# EAGLE design snarfbasebasics232-v03i (EAGLE 5.11)
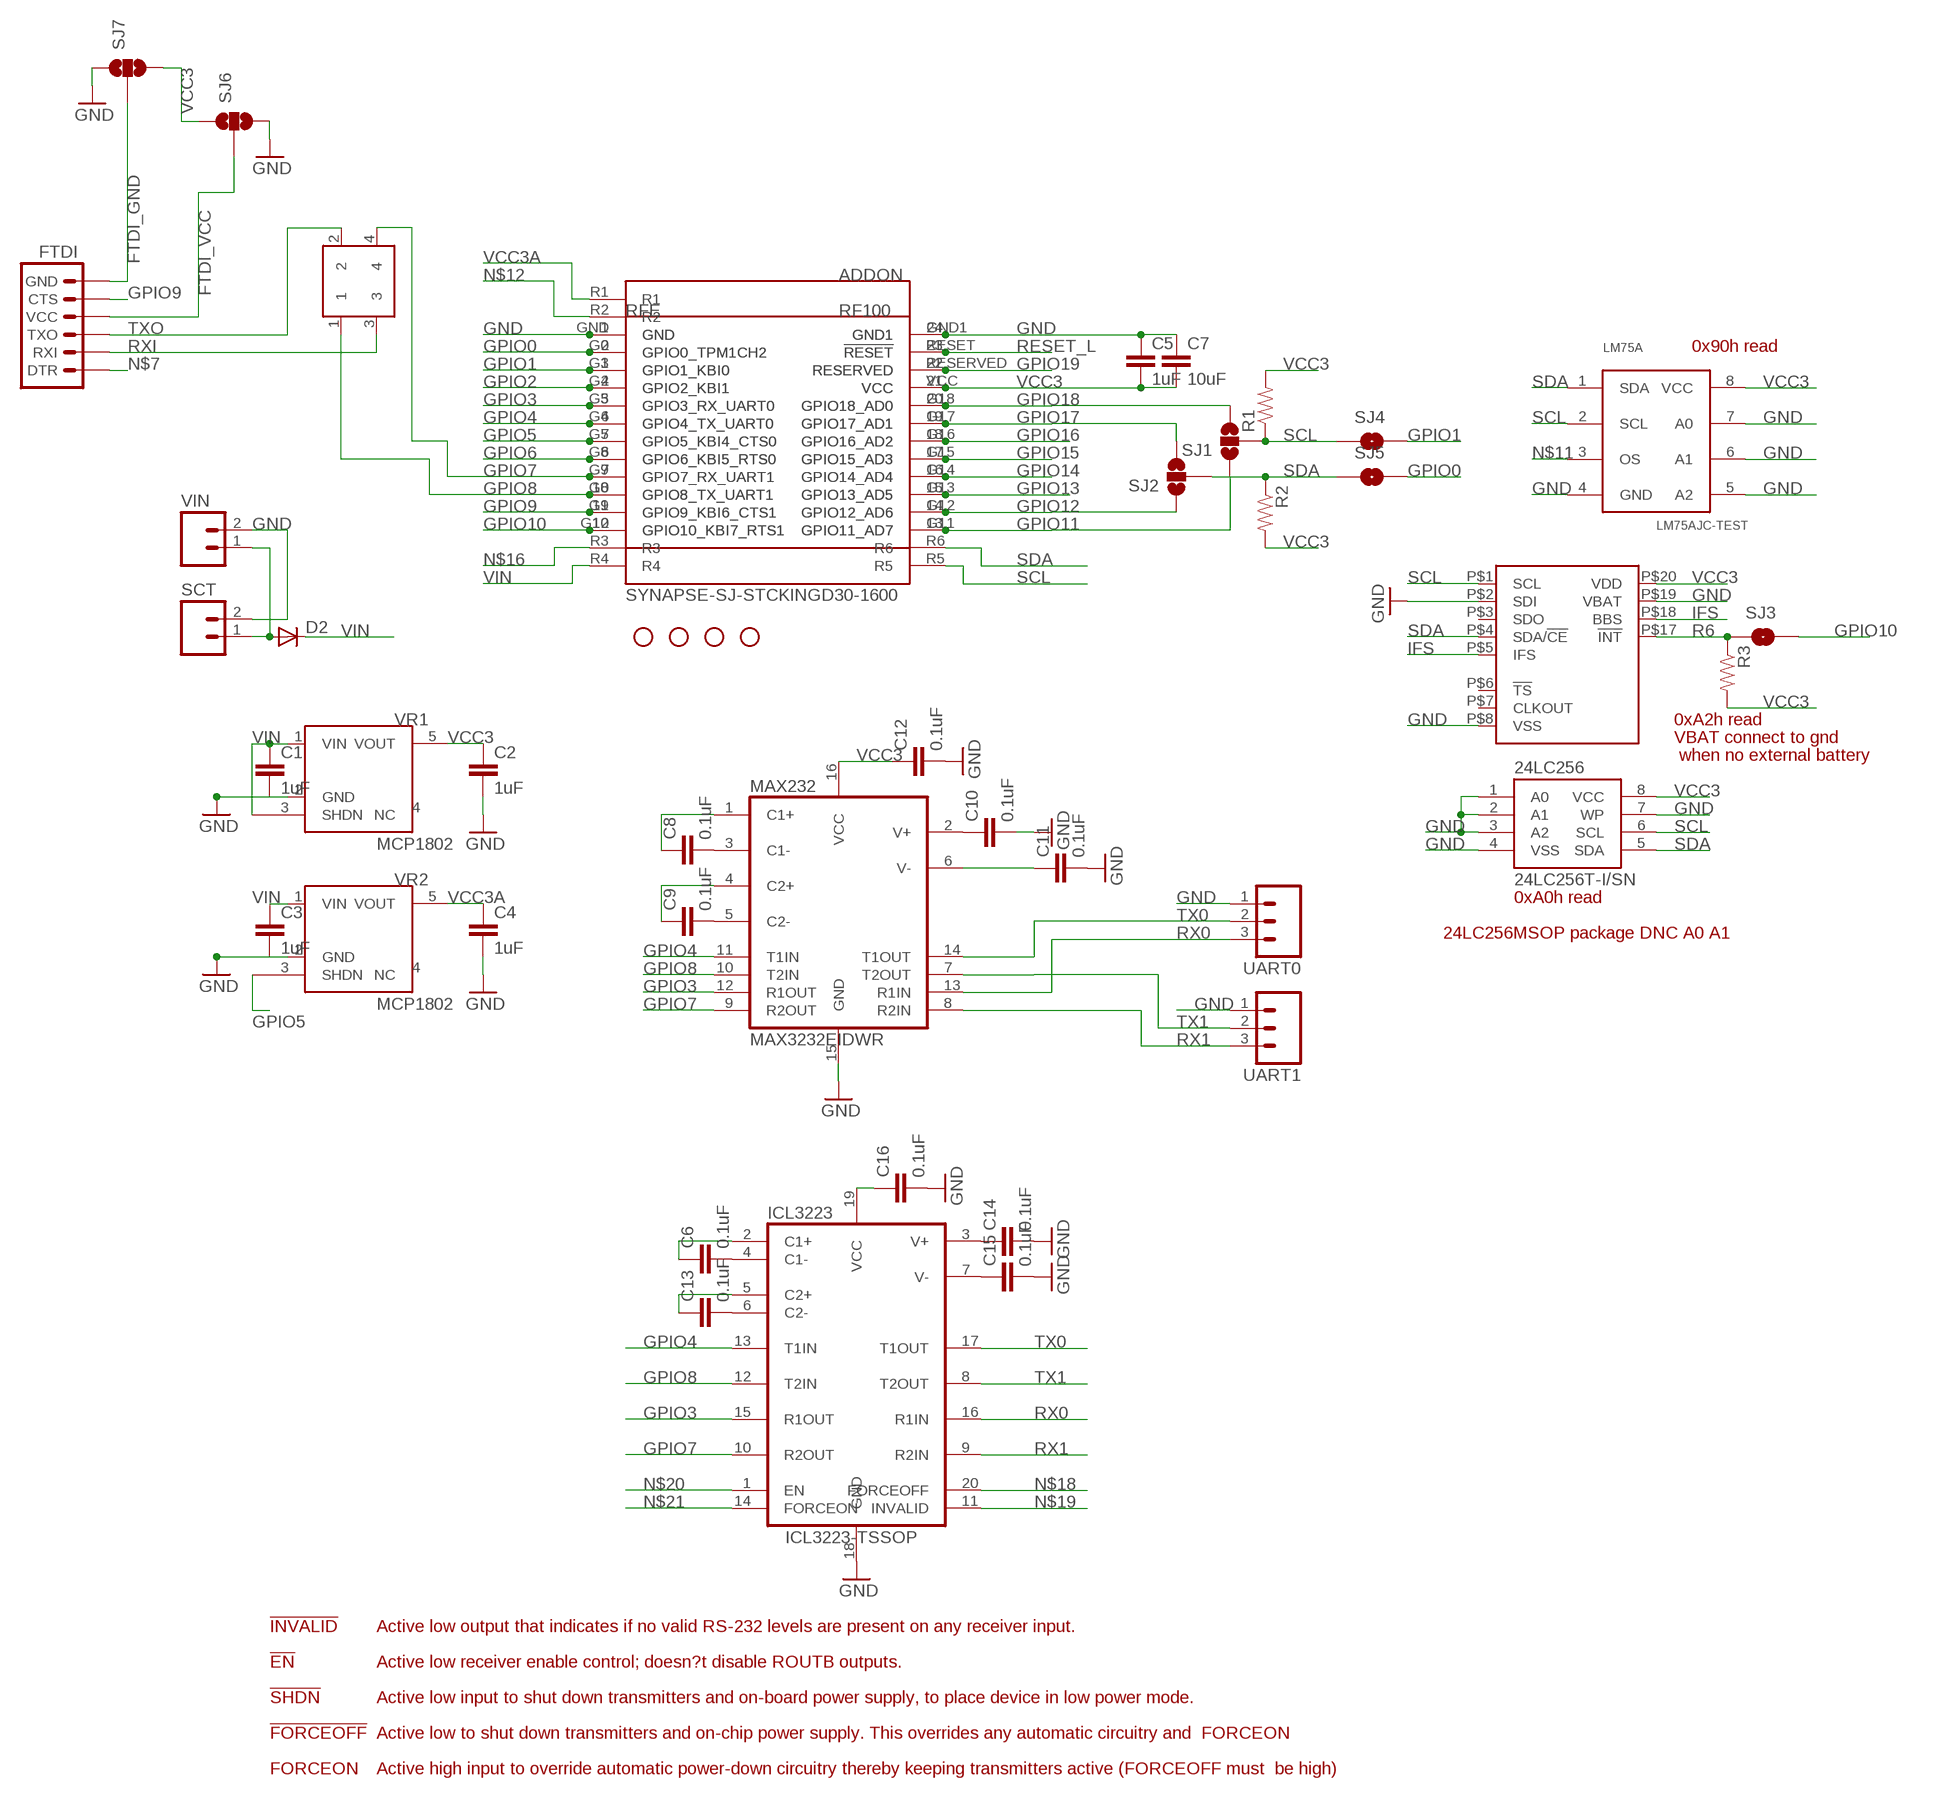
[diagram p0: schematic, sheet 1]

## Parts
24LC256  24LC256T-I/SN  EEPROM-I2CSMD  [SO08]
ADDON  SYNAPSE-SJ-STCKINGD30-1600  [SYNSJ-STACK]
C1  1uF  CAP0805  [0805]
C2  1uF  CAP0805  [0805]
C3  1uF  CAP0805  [0805]
C4  1uF  CAP0805  [0805]
C5  1uF  CAP0805  [0805]
C6  0.1uF  CAP0805  [0805]
C7  10uF  CAP0805  [0805]
C8  0.1uF  CAP0805  [0805]
C9  0.1uF  CAP0805  [0805]
C10  0.1uF  CAP0805  [0805]
C11  0.1uF  CAP0805  [0805]
C12  0.1uF  CAP0805  [0805]
C13  0.1uF  CAP0805  [0805]
C14  0.1uF  CAP0805  [0805]
C15  0.1uF  CAP0805  [0805]
C16  0.1uF  CAP0805  [0805]
D2  DIODESMA  [SMA-DIODE]
FTDI  ARDUINO_SERIAL_PROGRAMPTH  [1X06]
JP6  STAND-OFF  [STAND-OFF]
JP9  STAND-OFF  [STAND-OFF]
JP10  STAND-OFF  [STAND-OFF]
JP11  STAND-OFF  [STAND-OFF]
LM75A  LM75AJC-TEST  [TSSOP8-3MM]
MAX232  MAX3232EIDWR  MAX232SOIC16  [SO016]
PCF2129A  PCF2129ASO20  [SO20W]
R1  RESISTOR  [0805]
R2  RESISTOR  [0805]
R3  RESISTOR  [0805]
RFE  RFE  RF100-JACKJACK2  [SYNAPSERFENGINE-THM-SMT-JACK2]
RXTX  SERIAL_CROSSOVER  [2X02_PTH]
SCT  M023.5MM  [SCREWTERMINAL-3.5MM-2]
SJ1  SOLDERJUMPER_2WAYS  [SJ_3]
SJ2  SOLDERJUMPER_2WAYS  [SJ_3]
SJ3  SOLDERJUMPERNC2  [SJ_2S-NOTRACE]
SJ4  SOLDERJUMPERNO  [SJ_2S-NO]
SJ5  SOLDERJUMPERNO  [SJ_2S-NO]
SJ6  SOLDERJUMPER_2WAYPASTE1&2  [SJ_3_PASTE1&2]
SJ7  SOLDERJUMPER_2WAYPASTE1&2  [SJ_3_PASTE1&2]
U$1  ICL3223-TSSOP  [TSSOP20]
UART0  M03PTH  [1X03]
UART1  M03PTH  [1X03]
VIN  M02PTH  [1X02]
VR1  MCP1802  [SOT23-5]
VR2  MCP1802  [SOT23-5]

## Nets
FTDI_GND: FTDI.6(GND) SJ7.2
FTDI_VCC: FTDI.4(VCC) SJ6.2
GND: 24LC256.1(A0) 24LC256.2(A1) 24LC256.3(A2) 24LC256.4(VSS) 24LC256.7(WP) ADDON.GND ADDON.GND1 C1.2 C2.2 C3.2 C4.2 C5.1 C7.1 C10.2 C11.2 C12.2 C14.2 C15.2 C16.2 LM75A.4(GND) LM75A.5(A2) LM75A.6(A1) LM75A.7(A0) MAX232.15(GND) PCF2129A.P$2(SDI) PCF2129A.P$8(VSS) PCF2129A.P$19(VBAT) RFE.1(GND) RFE.24(GND1) RFE.P1 RFE.P24 RFE.P201 RFE.P224 SCT.2 SJ6.3 SJ7.1 U$1.18(GND) UART0.1 UART1.1 VIN.2 VR1.2(GND) VR2.2(GND)
GPIO0: ADDON.G0(GPIO0_TPM1CH2) RFE.2(GPIO0_TPM1CH2) RFE.P2 RFE.P202 SJ5.2
GPIO1: ADDON.G1(GPIO1_KBI0) RFE.3(GPIO1_KBI0) RFE.P3 RFE.P203 SJ4.2
GPIO2: ADDON.G2(GPIO2_KBI1) RFE.4(GPIO2_KBI1) RFE.P4 RFE.P204
GPIO3: ADDON.G3(GPIO3_RX_UART0) MAX232.12(R1OUT) RFE.5(GPIO3_RX_UART0) RFE.P5 RFE.P205 U$1.15(R1OUT)
GPIO4: ADDON.G4(GPIO4_TX_UART0) MAX232.11(T1IN) RFE.6(GPIO4_TX_UART0) RFE.P6 RFE.P206 U$1.13(T1IN)
GPIO5: ADDON.G5(GPIO5_KBI4_CTS0) RFE.7(GPIO5_KBI4_CTS0) RFE.P7 RFE.P207 VR2.3(SHDN)
GPIO6: ADDON.G6(GPIO6_KBI5_RTS0) RFE.8(GPIO6_KBI5_RTS0) RFE.P8 RFE.P208
GPIO7: ADDON.G7(GPIO7_RX_UART1) MAX232.9(R2OUT) RFE.9(GPIO7_RX_UART1) RFE.P9 RFE.P209 RXTX.4 U$1.10(R2OUT)
GPIO8: ADDON.G8(GPIO8_TX_UART1) MAX232.10(T2IN) RFE.10(GPIO8_TX_UART1) RFE.P10 RFE.P210 RXTX.1 U$1.12(T2IN)
GPIO9: ADDON.G9(GPIO9_KBI6_CTS1) FTDI.5(CTS) RFE.11(GPIO9_KBI6_CTS1) RFE.P11 RFE.P211
GPIO10: ADDON.G10(GPIO10_KBI7_RTS1) RFE.12(GPIO10_KBI7_RTS1) RFE.P12 RFE.P212 SJ3.2
GPIO11: ADDON.G11(GPIO11_AD7) RFE.13(GPIO11_AD7) RFE.P13 RFE.P213 SJ1.1
GPIO12: ADDON.G12(GPIO12_AD6) RFE.14(GPIO12_AD6) RFE.P14 RFE.P214 SJ2.1
GPIO13: ADDON.G13(GPIO13_AD5) RFE.15(GPIO13_AD5) RFE.P15 RFE.P215
GPIO14: ADDON.G14(GPIO14_AD4) RFE.16(GPIO14_AD4) RFE.P16 RFE.P216
GPIO15: ADDON.G15(GPIO15_AD3) RFE.17(GPIO15_AD3) RFE.P17 RFE.P217
GPIO16: ADDON.G16(GPIO16_AD2) RFE.18(GPIO16_AD2) RFE.P18 RFE.P218
GPIO17: ADDON.G17(GPIO17_AD1) RFE.19(GPIO17_AD1) RFE.P19 RFE.P219 SJ2.3
GPIO18: ADDON.G18(GPIO18_AD0) RFE.20(GPIO18_AD0) RFE.P20 RFE.P220 SJ1.3
GPIO19: ADDON.RESERVED RFE.22(RESERVED) RFE.P22 RFE.P222
IFS: PCF2129A.P$5(IFS) PCF2129A.P$18(BBS)
N$1: C8.2 MAX232.3(C1-)
N$2: D2.A SCT.1 VIN.1
N$3: C6.2 U$1.4(C1-)
N$4: C9.2 MAX232.5(C2-)
N$5: C10.1 MAX232.2(V+)
N$6: C11.1 MAX232.6(V-)
N$7: FTDI.1(DTR)
N$8: C8.1 MAX232.1(C1+)
N$9: C13.2 U$1.6(C2-)
N$10: C9.1 MAX232.4(C2+)
N$11: LM75A.3(OS)
N$12: ADDON.R2
N$13: C14.1 U$1.3(V+)
N$14: C15.1 U$1.7(V-)
N$15: C13.1 U$1.5(C2+)
N$16: ADDON.R3
N$17: C6.1 U$1.2(C1+)
N$18: U$1.20(FORCEOFF)
N$19: U$1.11(INVALID)
N$20: U$1.1(EN)
N$21: U$1.14(FORCEON)
R6: PCF2129A.P$17(!INT) R3.1 SJ3.1
RESET_L: ADDON.RESET(!RESET) RFE.23(!RESET) RFE.P23 RFE.P223
RX0: MAX232.13(R1IN) U$1.16(R1IN) UART0.3
RX1: MAX232.8(R2IN) U$1.9(R2IN) UART1.3
RXI: FTDI.2(RXI) RXTX.3
SCL: 24LC256.6(SCL) ADDON.R5 LM75A.2(SCL) PCF2129A.P$1(SCL) R1.1 SJ1.2 SJ4.1
SDA: 24LC256.5(SDA) ADDON.R6 LM75A.1(SDA) PCF2129A.P$4(SDA/!CE) R2.1 SJ2.2 SJ5.1
TX0: MAX232.14(T1OUT) U$1.17(T1OUT) UART0.2
TX1: MAX232.7(T2OUT) U$1.8(T2OUT) UART1.2
TXO: FTDI.3(TXO) RXTX.2
VCC3: 24LC256.8(VCC) ADDON.VCC C2.1 C5.2 C7.2 C12.1 C16.1 LM75A.8(VCC) MAX232.16(VCC) PCF2129A.P$20(VDD) R1.2 R2.2 R3.2 RFE.21(VCC) RFE.P21 RFE.P221 SJ6.1 SJ7.3 U$1.19(VCC) VR1.5(VOUT)
VCC3A: ADDON.R1 C4.1 VR2.5(VOUT)
VIN: ADDON.R4 C1.1 C3.1 D2.C VR1.1(VIN) VR1.3(SHDN) VR2.1(VIN)
Unconnected: PCF2129A.P$3(SDO) PCF2129A.P$6(!TS) PCF2129A.P$7(CLKOUT) VR1.4(NC) VR2.4(NC)

## Notes on the sheet
- 0x90h read
- 0xA2h read
- VBAT connect to gnd
- when no external battery
- 0xA0h read
- 24LC256MSOP package DNC A0 A1
- !INVALID | Active low output that indicates if no valid RS-232 levels are present on any receiver input.
- !EN | Active low receiver enable control; doesn?t disable ROUTB outputs.
- !SHDN | Active low input to shut down transmitters and on-board power supply, to place device in low power mode.
- !FORCEOFF | Active low to shut down transmitters and on-chip power supply. This overrides any automatic circuitry and  FORCEON
- FORCEON | Active high input to override automatic power-down circuitry thereby keeping transmitters active (FORCEOFF must  be high)

## Library data of the parts
24LC256 = SparkFun:EEPROM-I2C
ADDON = 0_jc-custom:SYNAPSE-SJ-STCKING: Standard layout for expansion modules using Synapse Wireless boards
C1-C16 = 0_jc-custom:CAP: Capacitor Standard 0603 ceramic capacitor, and 0.1" leaded capacitor.
D2 = SparkFun:DIODE: Diode These are standard reverse protection diodes and small signal diodes. SMA package can handle up to about 1A. SOD-323 can handle about 200mA. What the SOD-323 package when ordering, there are some mfgs out there that are 5-pin packages.
FTDI = SparkFun:ARDUINO_SERIAL_PROGRAM
JP6 JP9-JP11 = SparkFun:STAND-OFF: Stand Off This is the mechanical footprint for a #4 phillips button head screw. Use the keepout ring to avoid running the screw head into surrounding components. SKU : PRT-00447
LM75A = 0_jc-custom:LM75A
MAX232 = SparkFun:MAX232: RS232 Transceiver Very common IC. This is generically called 'MAX232', but works with the 3V equivalent MAX3232 generic ICs. Field tested and mother approved. Spark Fun Electronics SKU : COM-00316 (DIP) and COM-00589 (SMD)
PCF2129A = 0_jc-custom:PCF2129A
R1-R3 = SparkFun:RESISTOR: Resistor Basic schematic elements and footprints for 0603, 1206, and PTH 1/10th watt (small) resistors.
RFE = 0_jc-custom:RF100-JACK
RXTX = 0_jc-custom:SERIAL_CROSSOVER
SCT VIN = SparkFun:M02: Header 2 Standard 2-pin 0.1" header. Use with straight break away headers (SKU : PRT-00116), right angle break away headers (PRT-00553), swiss pins (PRT-00743), machine pins (PRT-00117), and female headers (PRT-00115). Molex polarized connector foot print use with SKU : PRT-08233 with associated crimp pins and housings.
SJ1 SJ2 SJ6 SJ7 = SparkFun:SOLDERJUMPER_2WAY: Solder Jumper 2 way solder jumper
SJ3-SJ5 = SparkFun:SOLDERJUMPER: Solder Jumper Standard SMD solder jumper. Used to automate production. Two varients : Normally Open and Normally Closed are the same, but have different paste layers. NC will have a large amount of paste and should jumper during reflow.
U$1 = ssozonoff:ICL3223-TSSOP
UART0 UART1 = SparkFun:M03: Header 3 Standard 3-pin 0.1" header. Use with straight break away headers (SKU : PRT-00116), right angle break away headers (PRT-00553), swiss pins (PRT-00743), machine pins (PRT-00117), and female headers (PRT-00115). Molex polarized connector foot print use with SKU : PRT-08232 with associated crimp pins and housings.
VR1 VR2 = 0_jc-custom:MCP1802

## Net classes
0 default: width 0.254 mm
1 Power: width 0.508 mm
2 smallsignal: width 0.152 mm
3 stdsignal: width 0.254 mm

## Board
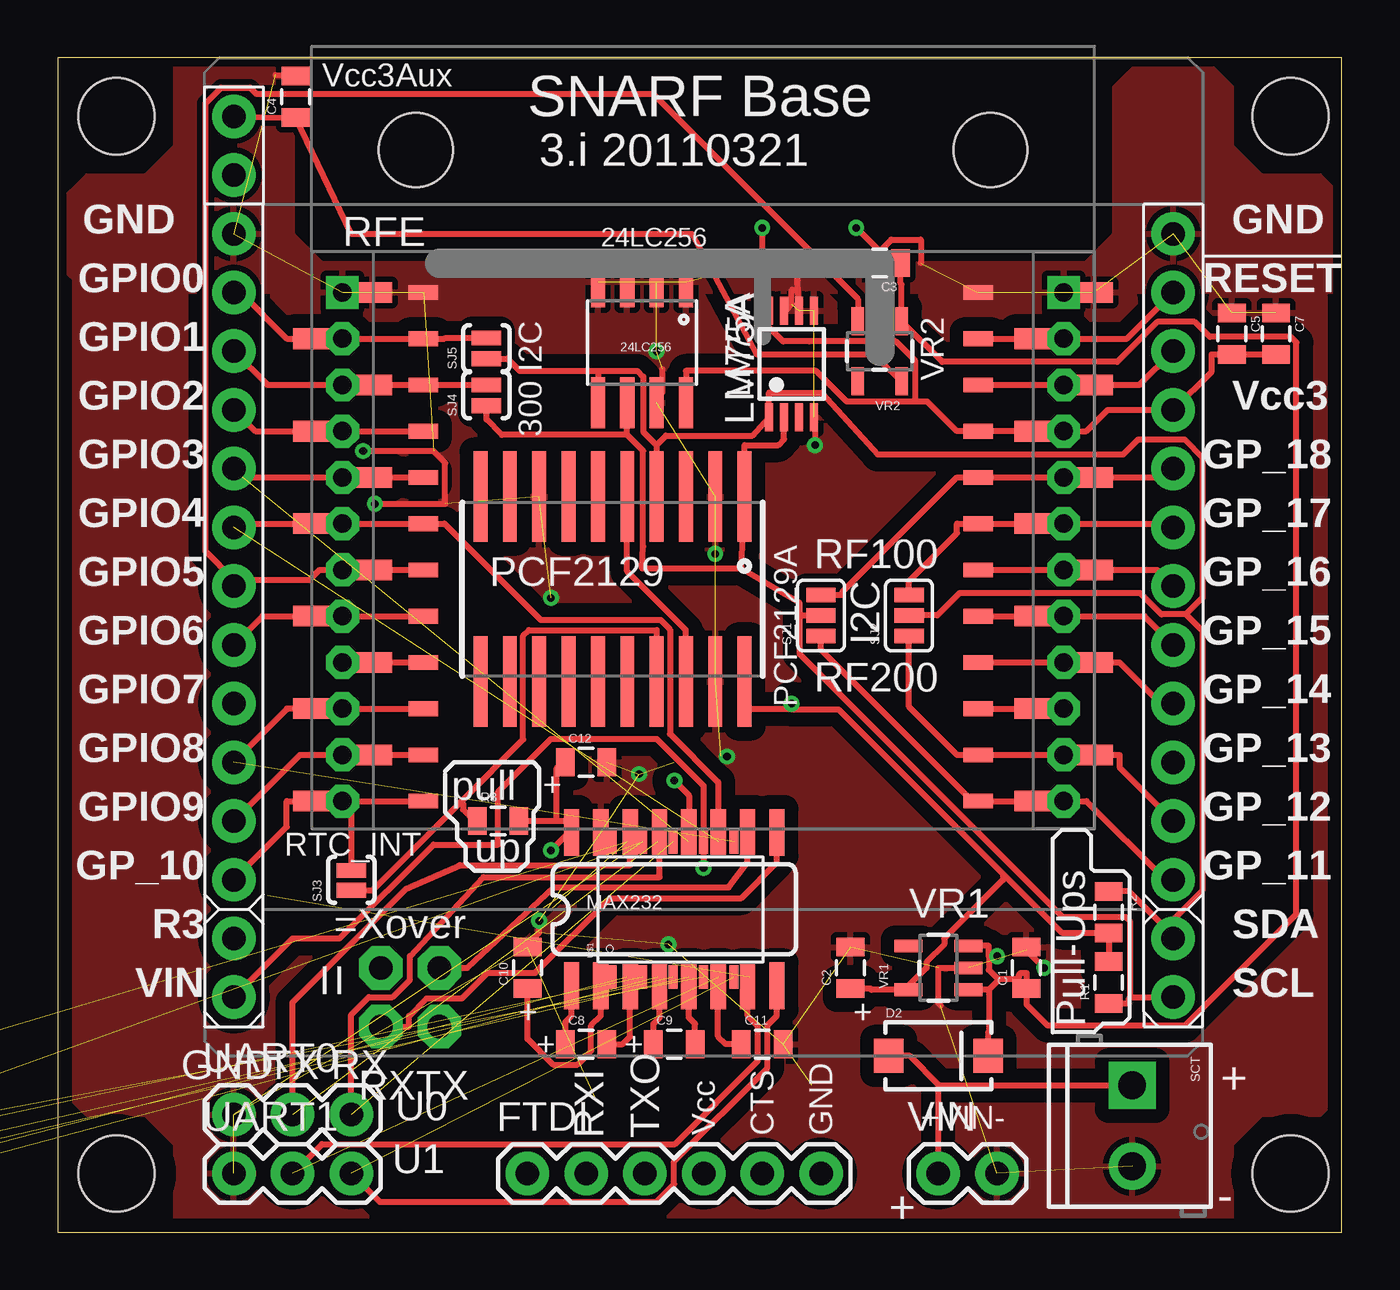
[diagram p1: board, top side]
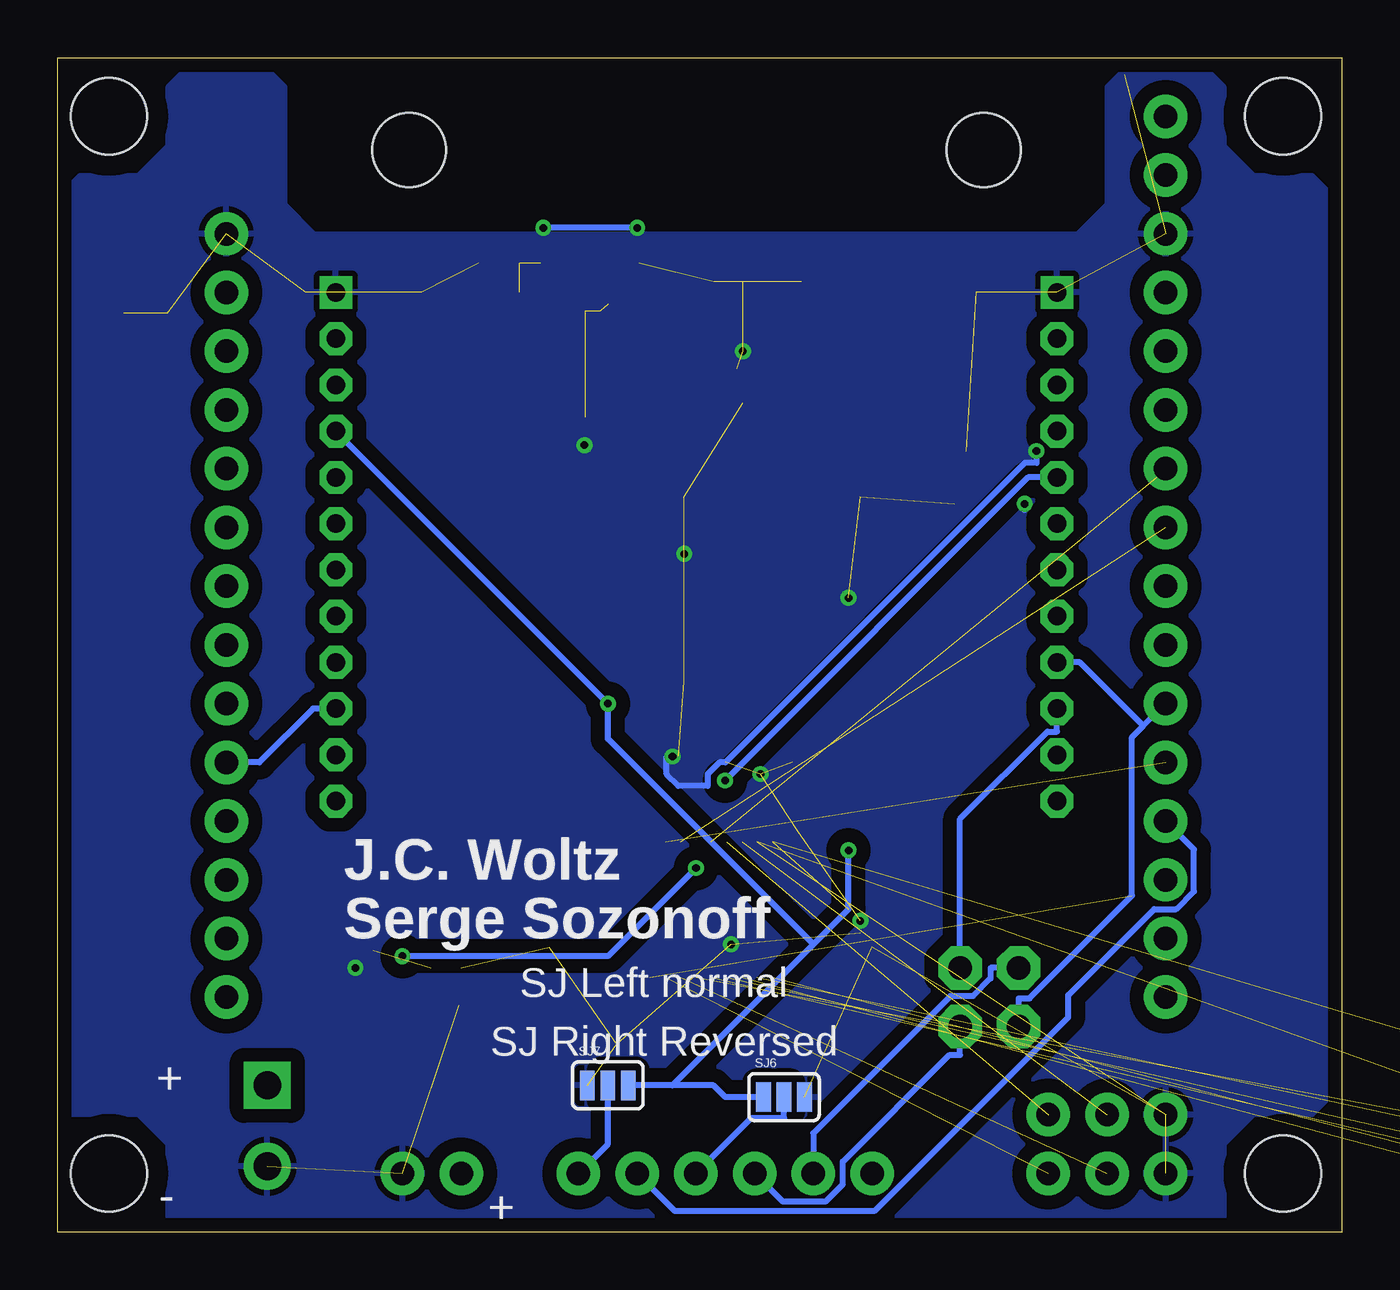
[diagram p2: board, bottom side, seen from below]

Size 55.55 x 50.79 mm. Coordinates in mm from the lower left corner, seen from the top.
Outline: 0,0 55.55,0 55.55,50.79 0,50.79 0,0
Copper layers (1*16): Top 0.0356mm / dielectric 1.5011mm / Bottom 0.0356mm
Design rules "LaenPCBOrder-JCModified": minimum track width 6mil, minimum drill 13mil, track to track 6mil, track to pad 6mil, pad to pad 6mil, via to via 6mil, smd to smd 6mil, copper to edge 15mil, drill to drill 6mil, minimum pad ring 12mil, minimum via ring 7mil, stop-mask expansion 4mil, vias tented up to drill 25mil, thermal gap 10mil

### Footprints (pad centres in the part's own frame; a part is rotated, then mirrored left to right if it is on the bottom)
SO08 = smd 0.61 x 2.21: 1 -1.905,-2.616; 2 -0.635,-2.616; 3 0.635,-2.616; 4 1.905,-2.616; 5 1.905,2.616; 6 0.635,2.616; 7 -0.635,2.616; 8 -1.905,2.616
SYNSJ-STACK = drill 1.016 pad 1.88 round: G0 0,-7.62; G1 0,-10.16; G2 0,-12.7; G3 0,-15.24; G4 0,-17.78; G5 0,-20.32; G6 0,-22.86; G7 0,-25.4; G8 0,-27.94; G9 0,-30.48; G10 0,-33.02; G11 40.64,-33.02; G12 40.64,-30.48; G13 40.64,-27.94; G14 40.64,-25.4; G15 40.64,-22.86; G16 40.64,-20.32; G17 40.64,-17.78; G18 40.64,-15.24; GND 0,-5.08; GND1 40.64,-5.08; R1 0,0; R2 0,-2.54; R3 0,-35.56; R4 0,-38.1; R5 40.64,-38.1; R6 40.64,-35.56; RESERVED 40.64,-10.16; RESET 40.64,-7.62; VCC 40.64,-12.7
0805 = smd 0.8 x 1.2: 1 -0.9,0; 2 0.9,0
SMA-DIODE = smd 1.27 x 1.47: A -2.15,0; C 2.15,0
1X06 = drill 1.016 pad 1.88 round: 1 0,0; 2 2.54,0; 3 5.08,0; 4 7.62,0; 5 10.16,0; 6 12.7,0
STAND-OFF = hole 3.302: 0,0
TSSOP8-3MM = smd 1.2 x 0.35: 1 -2.6,0.975; 2 -2.6,0.325; 3 -2.6,-0.325; 4 -2.6,-0.975; 5 2,-0.975; 6 2,-0.325; 7 2,0.325; 8 2,0.975
SO016 = smd 0.66 x 2.032: 1 -4.445,-3.315; 2 -3.175,-3.315; 3 -1.905,-3.315; 4 -0.635,-3.315; 5 0.635,-3.315; 6 1.905,-3.315; 7 3.175,-3.315; 8 4.445,-3.315; 9 4.445,3.315; 10 3.175,3.315; 11 1.905,3.315; 12 0.635,3.315; 13 -0.635,3.315; 14 -1.905,3.315; 15 -3.175,3.315; 16 -4.445,3.315
SO20W = smd 0.6 x 3.9: P$1 -5.715,-4; P$2 -4.445,-4; P$3 -3.175,-4; P$4 -1.905,-4; P$5 -0.635,-4; P$6 0.635,-4; P$7 1.905,-4; P$8 3.175,-4; P$9 4.445,-4; P$10 5.715,-4; P$11 5.715,4; P$12 4.445,4; P$13 3.175,4; P$14 1.905,4; P$15 0.635,4; P$16 -0.635,4; P$17 -1.905,4; P$18 -3.175,4; P$19 -4.445,4; P$20 -5.715,4
SYNAPSERFENGINE-THM-SMT-JACK2 = drill 0.8 square: 1 0,0; 24 31.2,0 | drill 0.8 pad 1.422 octagon: 2 0,-2; 3 0,-4; 4 0,-6; 5 0,-8; 6 0,-10; 7 0,-12; 8 0,-14; 9 0,-16; 10 0,-18; 11 0,-20; 12 0,-22; 13 31.2,-22; 14 31.2,-20; 15 31.2,-18; 16 31.2,-16; 17 31.2,-14; 18 31.2,-12; 19 31.2,-10; 20 31.2,-8; 21 31.2,-6; 22 31.2,-4; 23 31.2,-2 | smd 1.67 x 0.89: P1 1.3,0; P2 -1.3,-2; P3 1.3,-4; P4 -1.3,-6; P5 1.3,-8; P6 -1.3,-10; P7 1.3,-12; P8 -1.3,-14; P9 1.3,-16; P10 -1.3,-18; P11 1.3,-20; P12 -1.3,-22; P13 29.9,-22; P14 32.5,-20; P15 29.9,-18; P16 32.5,-16; P17 29.9,-14; P18 32.5,-12; P19 29.9,-10; P20 32.5,-8; P21 29.9,-6; P22 32.5,-4; P23 29.9,-2; P24 32.5,0 | smd 1.27 x 0.635: P201 3.5,0; P202 3.5,-2; P203 3.5,-4; P204 3.5,-6; P205 3.5,-8; P206 3.5,-10; P207 3.5,-12; P208 3.5,-14; P209 3.5,-16; P210 3.5,-18; P211 3.5,-20; P212 3.5,-22; P213 27.5,-22; P214 27.5,-20; P215 27.5,-18; P216 27.5,-16; P217 27.5,-14; P218 27.5,-12; P219 27.5,-10; P220 27.5,-8; P221 27.5,-6; P222 27.5,-4; P223 27.5,-2; P224 27.5,0 | hole 3.2: 3.17,6.16; 28.03,6.16
2X02_PTH = drill 1.016 pad 1.88 octagon: 1 -1.27,-1.27; 2 -1.27,1.27; 3 1.27,-1.27; 4 1.27,1.27
SCREWTERMINAL-3.5MM-2 = drill 1.2 pad 2.032 square: 1 0,0 | drill 1.2 pad 2.032 round: 2 3.5,0
SJ_3 = smd 0.635 x 1.27: 1 -0.889,0; 2 0,0; 3 0.889,0
SJ_2S-NOTRACE = smd 0.635 x 1.27: 1 -0.45,0; 2 0.4,0
SJ_2S-NO = smd 0.635 x 1.27: 1 -0.45,0; 2 0.45,0
SJ_3_PASTE1&2 = smd 0.635 x 1.27: 1 -0.889,0; 2 0,0; 3 0.889,0
TSSOP20 = smd 1 x 0.4: 1 -2.937,2.693; 2 -2.937,2.032; 3 -2.937,1.372; 4 -2.937,0.712; 5 -2.937,0.051; 6 -2.937,-0.609; 7 -2.937,-1.27; 8 -2.943,-1.93; 9 -2.937,-2.59; 10 -2.937,-3.251; 11 2.905,-3.251; 12 2.905,-2.59; 13 2.911,-1.93; 14 2.905,-1.27; 15 2.905,-0.609; 16 2.905,0.051; 17 2.905,0.712; 18 2.905,1.372; 19 2.905,2.032; 20 2.905,2.693
1X03 = drill 1.016 pad 1.88 round: 1 0,0; 2 2.54,0; 3 5.08,0
1X02 = drill 1.016 pad 1.88 round: 1 0,0; 2 2.54,0
SOT23-5 = smd 0.55 x 1.2: 1 -0.95,-1.3; 2 0,-1.3; 3 0.95,-1.3; 4 0.95,1.3; 5 -0.95,1.3

### Placement (x,y rotation side)
24LC256  25.27,38.48 180 top
ADDON  7.62,48.26 0 top
C1  41.91,11.43 90 top
C2  34.29,11.43 90 top
C3  35.56,41.91 180 top
C4  10.29,49.1 90 top
C5  50.8,38.86 270 top
C6  -11.43,1.27 0 top  (outside the outline)
C7  52.7,38.86 270 top
C8  22.86,8.13 0 top
C9  26.67,8.13 0 top
C10  20.32,11.43 90 top
C11  30.48,8.13 0 top
C12  22.86,20.32 0 top
C13  -15.24,1.27 0 top  (outside the outline)
C14  -19.05,1.27 0 top  (outside the outline)
C15  -22.86,1.27 0 top  (outside the outline)
C16  -26.67,1.27 0 top  (outside the outline)
D2  38.1,7.62 0 top
FTDI  20.32,2.54 0 top
JP6  53.34,2.54 0 top
JP9  2.54,2.54 0 top
JP10  53.34,48.26 0 top
JP11  2.54,48.26 0 top
LM75A  31.75,37.85 90 top
MAX232  26.67,13.97 0 top
PCF2129A  24,27.81 180 top
R1  45.47,10.79 90 top
R2  45.47,13.84 270 top
R3  19.05,17.78 0 top
RFE  12.32,40.64 0 top
RXTX  15.24,10.16 180 top
SCT  46.48,6.35 270 top
SJ1  33.02,26.67 90 top
SJ2  36.83,26.67 90 top
SJ3  12.7,15.24 90 top
SJ4  18.54,36.2 90 top
SJ5  18.54,38.23 90 top
SJ6  24.13,5.84 0 bottom
SJ7  31.75,6.35 0 bottom
U$1  26.67,13.97 90 top
UART0  7.62,5.08 0 top
UART1  7.62,2.54 0 top
VIN  38.1,2.54 0 top
VR1  38.1,11.43 90 top
VR2  35.56,38.1 180 top

### Tracks (layer width: path | path; a pad name or v marks a point on that pad's centre or on a via)
FTDI_GND
  Bottom 0.254: SJ7.2 31.75,3.81 FTDI.6
FTDI_VCC
  Bottom 0.254: SJ6.2 24.13,4.93 25.55,4.93 FTDI.4
GND  (via drill 0.33)  (47 unrouted)
  Top 0.254: 9.41,50.05 C4.2 | v20.83,13.46 20.83,12.95 20.32,12.45 C10.2 | 35.56,40.64 35.56,39.62 VR2.2 | VR1.2 39.37,11.43 38.1,11.43 38.1,9.91 38.19,9.81 | v42.67,11.43 41.91,12.19 C1.2 | v32.77,34.04 32.77,35.05 LM75A.4 | 35.56,42.42 35.56,41.91 | 35.56,42.42 36.07,42.93 37.34,42.93 37.34,41.91 | v34.54,43.43 35.56,42.42 | 30.48,41.91 v30.48,43.43 | 30.48,41.91 30.4,41.91 30.48,41.91 | 30.48,41.91 31.75,41.91 31.75,41.66 32,41.4 32,41.15 LM75A.6 | v13.72,31.5 16.76,31.5 16.76,33.27 16.26,33.78 v13.21,33.78 | v28.96,20.57 28.7,20.57 | 26.16,37.34 26.16,36.32 25.91,36.07 24LC256.7 | LM75A.7 31.5,39.88 31.75,40.13 31.75,40.64 31.77,40.77
  Bottom 0.254: v30.48,43.43 v34.54,43.43 | v13.72,31.5 13.72,31.24 13.74,31.23 | v13.21,33.78 13.21,33.27 13.72,33.27 26.67,20.32 26.92,20.32 27.43,19.81 27.43,19.3 28.7,19.3 29.21,19.81 29.21,20.57 v28.96,20.57
  other vias: 25.15,19.81 26.42,12.45 21.34,27.43 28.45,29.34 25.91,38.1
  pour Top (isolate 0.61): 0,41.91 0,6.35 1.27,5.08 3.81,5.08 5.08,3.81 5.08,0 50.8,0 50.8,3.81 52.07,5.08 54.61,5.08 55.88,6.35 55.88,41.91
  pour Top (isolate 0.254): 0,41.91 0,44.45 1.27,45.72 3.81,45.72 5.08,46.99 5.08,50.8 8.89,50.8 10.16,49.53 10.16,43.18 11.43,41.91 44.45,41.91 45.72,43.18 45.72,49.53 46.99,50.8 49.53,50.8 50.8,49.53 50.8,46.99 52.07,45.72 54.61,45.72 55.88,44.45 55.88,40.64 1.27,40.64
  pour Bottom (isolate 0.61): 0,44.45 0,6.35 1.27,5.08 3.81,5.08 5.08,3.81 5.08,0 50.8,0 50.8,3.81 52.07,5.08 55.88,5.08 55.88,44.45 54.61,45.72 52.07,45.72 50.8,46.99 50.8,49.53 49.53,50.8 46.99,50.8 45.72,49.53 45.72,44.45 44.45,43.18 11.43,43.18 10.16,44.45 10.16,49.53 8.89,50.8 6.35,50.8 5.08,49.53 5.08,46.99 3.81,45.72 1.27,45.72
GPIO0
  Top 0.254: SJ5.2 16.77,38.68 16.73,38.64 RFE.P202 RFE.2 RFE.P2 9.9,38.64 7.9,40.64 ADDON.G0
GPIO1
  Top 0.254: SJ4.2 16.74,36.65 16.73,36.64 RFE.P203 RFE.P3 RFE.3 9.08,36.64 ADDON.G1
GPIO2
  Top 0.254: ADDON.G2 8.54,34.64 RFE.P4 RFE.4 RFE.P204
GPIO3  (via drill 0.33 pad 0.69)  (1 unrouted)
  Top 0.254: v26.68,19.53 27.3,18.91 MAX232.12 | RFE.P205 RFE.P5 RFE.5 8,32.64 ADDON.G3
  Bottom 0.254: RFE.5 13.57,32.64 v26.68,19.53
GPIO4  (1 unrouted)
  Top 0.254: MAX232.11 28.57,19.47 26.49,21.55 26.49,26.07 26.08,26.48 20.89,26.48 16.73,30.64 RFE.P206 RFE.6 RFE.P6 7.78,30.64 ADDON.G4
GPIO5
  Top 0.254: 7.62,28.22 10.9,28.22 11.33,28.64 RFE.7 RFE.P7 RFE.P207 | VR2.3 34.61,40.36 25.75,49.23 8.59,49.23 8.32,49.5 7.07,49.5 6.39,48.83 6.39,29.44 7.62,28.22 | 7.62,28.22 ADDON.G5
GPIO6
  Top 0.254: RFE.P208 RFE.8 RFE.P8 8.86,26.64 ADDON.G6
GPIO7  (1 unrouted)
  Top 0.254: MAX232.9 31.11,15.99 29.58,14.45 23.89,14.45 20.65,11.21 18.58,11.21 17.48,10.11 15.95,10.11 15.19,9.35 15.19,8.89 RXTX.4 | RFE.9 RFE.P9 RFE.P209
  Bottom 0.254: 8.58,21.9 ADDON.G7 | 8.58,21.9 9.07,21.41 9.07,14.55 13.51,10.11 13.97,10.11 RXTX.4 | 8.58,21.9 11.33,24.64 RFE.9
GPIO8  (1 unrouted)
  Top 0.254: RXTX.1 17.73,11.43 21.47,14.91 29.02,14.91 29.84,15.99 MAX232.10 | ADDON.G8 9.9,22.61 9.9,22.64 RFE.P10 RFE.10 RFE.P210
  Bottom 0.254: RFE.10 12.32,21.65 12.73,21.65 16.51,17.87 RXTX.1
GPIO9
  Top 0.254: ADDON.G9 10.48,20.64 RFE.11 RFE.P11 RFE.P211
  Bottom 0.254: ADDON.G9 6.4,16.56 6.4,14.73 7.16,13.97 8.12,13.97 11.83,10.25 11.83,9.29 20.22,0.91 28.85,0.91 FTDI.5
GPIO10
  Top 0.254: ADDON.G10 9.9,17.52 9.9,18.64 RFE.P12 RFE.12 12.7,18.64 | 12.7,18.64 RFE.P212 | 12.7,18.64 12.7,16.24 SJ3.2
GPIO11
  Top 0.254: ADDON.G11 47.91,15.24 44.51,18.64 RFE.13 RFE.P13 RFE.P213 39.56,18.64 33.02,25.18 SJ1.1
GPIO12
  Top 0.254: ADDON.G12 45.93,20.11 45.93,20.64 RFE.P14 RFE.14 RFE.P214 38.9,20.64 36.83,22.71 SJ2.1
GPIO13
  Top 0.254: RFE.15 RFE.P15 RFE.P215
  Bottom 0.254: RFE.15 44.51,22.64 46.83,20.32 ADDON.G13
GPIO14
  Top 0.254: ADDON.G14 47.71,22.86 45.93,24.64 RFE.P16 RFE.16 RFE.P216
GPIO15
  Top 0.254: ADDON.G15 47.02,26.64 RFE.17 RFE.P17 RFE.P217
GPIO16
  Top 0.254: ADDON.G16 47.56,28.64 RFE.P18 RFE.18 RFE.P218
GPIO17
  Top 0.254: SJ2.3 36.83,28.16 38.9,30.23 38.9,30.64 RFE.P219 RFE.P19 RFE.19 48.1,30.64 ADDON.G17
GPIO18
  Top 0.254: SJ1.3 33.93,27.56 33.93,27.67 38.9,32.64 RFE.P220 40.73,32.64 42.53,32.64 RFE.20 RFE.P20 47.88,32.64 ADDON.G18
GPIO19
  Top 0.254: ADDON.RESERVED 46.8,36.64 RFE.P22 RFE.22 RFE.P222
IFS
  Top 0.254: PCF2129A.P$18 27.18,26.04 24.64,28.58 PCF2129A.P$5
N$1
  Top 0.254: C8.2 24.44,8.13 24.77,8.45 MAX232.3
N$2
  Top 0.254: 38.1,6.35 38.1,6.38 36.86,7.62 D2.A | VIN.1 38.1,6.35 | 38.1,6.35 SCT.1
N$3  (1 unrouted)
N$4
  Top 0.254: C9.2 27.57,9.01 27.3,9.27 MAX232.5
N$5
  Top 0.254: MAX232.2 23.5,9.36 23.08,8.95 23.08,7.85 22.48,7.25 21.43,7.25 20.32,8.36 C10.1
N$6
  Top 0.254: C11.1 28.9,8.13 28.57,8.45 MAX232.6
N$8
  Top 0.254: MAX232.1 22.23,9.36 21.96,9.1 C8.1
N$9  (1 unrouted)
N$10
  Top 0.254: C9.1 25.77,9.01 26.04,9.27 MAX232.4
N$13  (1 unrouted)
N$14  (1 unrouted)
N$15  (1 unrouted)
N$17  (1 unrouted)
R6
  Top 0.254: PCF2129A.P$17 25.91,26.04 20.38,26.04 20.14,25.8 20.14,21.31 17.45,18.62 | SJ3.1 13.61,14.79 17.45,18.62 | R3.1 18.03,17.78 17.53,18.29 17.53,18.54 17.45,18.62
RESET_L
  Top 0.254: ADDON.RESET 46.26,38.64 RFE.23 RFE.P23 RFE.P223
RX0  (1 unrouted)
  Top 0.254: UART0.3 12.7,9.41 13.45,10.16 14.48,10.16 15.24,10.92 15.24,11.93 18.41,15.35 26.04,15.35 MAX232.13
RX1  (1 unrouted)
  Top 0.254: MAX232.8 31.11,9.36 30.7,8.94 30.7,7.1 26.67,3.07 26.67,2.08 25.9,1.31 13.93,1.31 UART1.3
RXI
  Bottom 0.254: RXTX.3 15.19,11.43 15.19,10.97 15.95,10.21 16.93,10.21 22.86,4.28 FTDI.2
SCL
  Top 0.254: 29.59,28.7 25.28,28.7 25.33,29.66 25.33,33.79 24.64,34.48 | 32.1,26.67 32.1,27.2 29.59,28.7 | 24.64,34.48 24LC256.6 | SJ4.1 18.54,35.15 19.21,34.48 24.64,34.48 | R1.1 46.35,9.89 46.35,10.11 46.4,10.16 | 46.4,10.16 46.4,13.45 46.22,13.62 43.48,13.62 32.1,25 32.1,26.67 | 46.4,10.16 ADDON.R5 | 32.1,26.67 SJ1.2 | 29.59,28.7 PCF2129A.P$1 29.72,34.04 31.17,34.04 31.43,34.3 LM75A.2
SDA
  Top 0.254: 48.81,26.72 49.52,27.43 49.52,33.52 48.76,34.29 46.75,34.29 46.1,33.64 35.48,33.64 33.06,36.31 30.77,36.31 LM75A.1 30.05,34.45 26.32,34.45 25.91,34.04 | 48.81,26.72 47.76,26.72 46.84,27.64 39.02,27.64 38.05,26.67 SJ2.2 | 48.81,26.72 49.51,26.01 49.51,14.77 47.92,13.17 | 47.92,13.17 46.35,14.74 R2.1 | ADDON.R6 47.92,13.04 47.92,13.17 | 25.91,34.04 25.91,33.94 PCF2129A.P$4 | 25.91,34.04 25.32,34.63 25.32,37 25.07,37.25 23.37,37.25 | 23.37,37.25 24LC256.5 | SJ5.1 19.46,37.78 19.98,37.25 23.37,37.25
TX0  (1 unrouted)
  Top 0.254: UART0.2 10.16,9.94 15.07,14.85 17.4,15.88 24.77,15.88 MAX232.14
TX1  (1 unrouted)
  Top 0.254: MAX232.7 29.84,9.36 30.29,8.91 30.29,7.41 26.7,3.81 11.43,3.81 UART1.2
TXO
  Bottom 0.254: RXTX.2 16.51,7.67 16.97,7.67 21.59,3.05 21.59,2.06 22.34,1.31 24.18,1.31 FTDI.3
VCC3  (via drill 0.33)  (2 unrouted)
  Top 0.254: 37.1,35.92 34.14,35.92 32.81,37.25 27.18,37.25 24LC256.8 | 37.1,35.92 37.62,35.92 38.9,34.64 RFE.P221 RFE.P21 RFE.21 44.51,34.64 45.43,35.56 ADDON.VCC 49.92,37.22 49.92,37.96 C5.2 C7.2 | 37.1,35.92 37.1,37.68 36.26,38.52 32.51,38.52 31.38,38.52 30.73,39.17 30.73,39.62 30.73,40.39 LM75A.8 | C2.1 34.73,10.53 35.17,10.53 35.22,10.48 VR1.5 36.83,10.67 37.59,11.43 37.59,11.68 38.35,12.45 38.35,12.7 40.89,15.24 40.89,15.49 | R1.2 R2.2 45.47,12.95 43.43,12.95 40.89,15.49 | 21.59,17.78 20.07,17.78 R3.2 | 21.59,17.78 22.1,17.78 22.1,17.53 MAX232.16 22.1,17.27 v21.34,16.51 | 21.59,17.78 21.59,20.07 21.84,20.32 C12.1 | 40.89,15.49 33.78,22.61 31.75,22.61 | 31.75,22.61 29.72,22.61 29.72,23.62 PCF2129A.P$20 | v31.75,22.86 31.75,22.61
  Bottom 0.254: 28.96,6.35 30.73,6.35 SJ7.3 | 28.96,6.35 27.18,6.35 26.67,5.84 25.15,5.84 SJ6.1 | v21.34,16.51 21.34,13.97 22.86,12.45 | 28.96,6.35 22.86,12.45 | RFE.21 43.43,34.54 v31.75,22.86 31.75,21.34 22.86,12.45
VCC3A
  Top 0.254: ADDON.R1 C4.1 12.7,43.18 27.43,43.18 30.23,37.97 35.24,37.97 VR2.5
VIN  (via drill 0.33)
  Top 0.254: C3.1 36.46,41.03 36.51,40.98 VR2.1 38.27,37.64 45.84,37.64 47.56,39.37 49.19,39.37 49.84,38.72 53.35,38.72 53.59,38.49 53.59,13.74 48.78,8.94 42.82,8.94 41.91,9.85 C1.1 41.91,11.21 41.66,11.21 41.59,11.13 41.59,11.02 41.51,10.95 40.67,10.95 | VR1.3 40.28,12.38 40.28,11.94 | 40.67,10.95 40.67,10.88 40.28,10.48 | 40.28,11.94 40.28,11.35 40.67,10.95 | 40.28,10.48 40.28,8.66 40.25,8.63 D2.C | 40.28,10.48 VR1.1 | ADDON.R4 10.16,12.7 12.19,12.7 16.26,16.76 19.05,16.76 19.05,19.05 21.34,21.34 25.91,21.34 27.94,19.3 v27.94,15.75 | v40.64,11.94 40.39,11.94 40.28,11.94
  Bottom 0.254: v27.94,15.75 31.75,11.94 v40.64,11.94

### Text on the board
tPlace: Vcc3Aux | SNARF Base | 3.i 20110321 | GND | 24LC256 | GND | GPIO0 | LM75A | !RESET | GPIO1 | GPIO2 | VR2 | Vcc3 | GPIO3 | 300 I2C | GP_18 | GPIO4 | RF100 | GP_17 | GPIO5 | PCF2129 | GP_16 | GPIO6 | I2C | RF200 | GP_15 | GPIO7 | GP_14 | GPIO8 | GP_13 | GPIO9 | pull | + | GP_12 | GP_10 | RTC_INT | up | GP_11 | R3 | VR1 | =Xover | SDA | VIN | = | SCL | + | + | Pull-Ups | + | + | GND | TX | RX | + | U0 | RXI | TXO | Vcc | CTS | GND | +VIN- | U1 | - | +
bPlace: J.C. Woltz | Serge Sozonoff | SJ Left normal | SJ Right Reversed | + | - | +